# EAGLE design laserdriver_v3_1 (EAGLE 7.5.0)
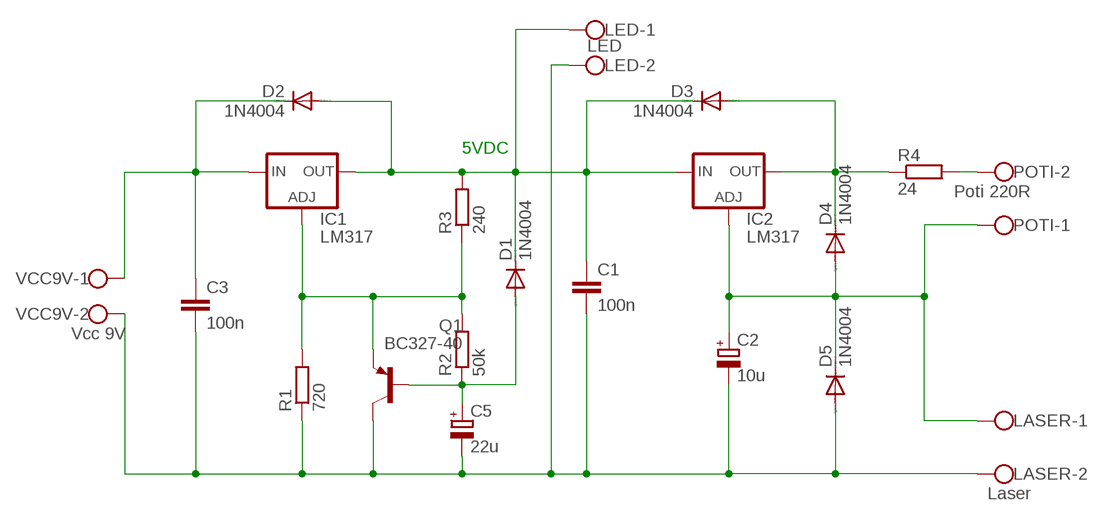
[diagram p0: schematic, sheet 1]

## Parts
C1  100n  C-EU050-024X044  [C050-024X044]
C2  10u  CPOL-EUE2-5  [E2-5]
C3  100n  C-EU050-024X044  [C050-024X044]
C5  22u  CPOL-EUE2-5  [E2-5]
D1  1N4004  [DO41-10]
D2  1N4004  [DO41-10]
D3  1N4004  [DO41-10]
D4  1N4004  [DO41-10]
D5  1N4004  [DO41-10]
IC1  LM317  LM317TS  [317TS]
IC2  LM317  LM317TS  [317TS]
LASER  Laser  W237-102  [W237-102]
LED  LED  W237-102  [W237-102]
POTI  Poti 220R  W237-102  [W237-102]
Q1  BC327-40  [TO92-EBC]
R1  720  R-EU_0207/7  [0207/7]
R2  50k  R-EU_0207/7  [0207/7]
R3  240  R-EU_0207/7  [0207/7]
R4  24  R-EU_0207/7  [0207/7]
VCC9V  Vcc 9V  W237-102  [W237-102]

## Nets
N$1: C1.1 D1.C D2.A D3.C IC1.2(OUT) IC2.3(IN) LED.1 R3.2
N$2: C2.+ D4.A D5.C IC2.1(ADJ) LASER.1 POTI.1
N$3: D3.A D4.C IC2.2(OUT) R4.1
N$4: POTI.2 R4.2
N$5: C5.+ D1.A Q1.B R2.1
N$7: C3.1 D2.C IC1.3(IN) VCC9V.1
N$9: C1.2 C2.- C3.2 C5.- D5.A LASER.2 LED.2 Q1.C R1.1 VCC9V.2
N$12: IC1.1(ADJ) Q1.E R1.2 R2.2 R3.1

## Notes on the sheet
- 5VDC

## Library data of the parts
C1 C3 = rcl:C-EU: CAPACITOR, European symbol
C2 C5 = rcl:CPOL-EU: POLARIZED CAPACITOR, European symbol
D1-D5 = diode:1N4004: DIODE general purpose rectifier, 1 A
IC1 IC2 = v-reg:LM317TS: VOLTAGE REGULATOR
LASER LED POTI VCC9V = con-wago-500:W237-102: WAGO SCREW CLAMP; MPN: 237-102; OC_FARNELL: unknown; OC_NEWARK: 70K9898
Q1 = transistor-pnp:BC327*: PNP Transistror
R1-R4 = rcl:R-EU_: RESISTOR, European symbol

## Board
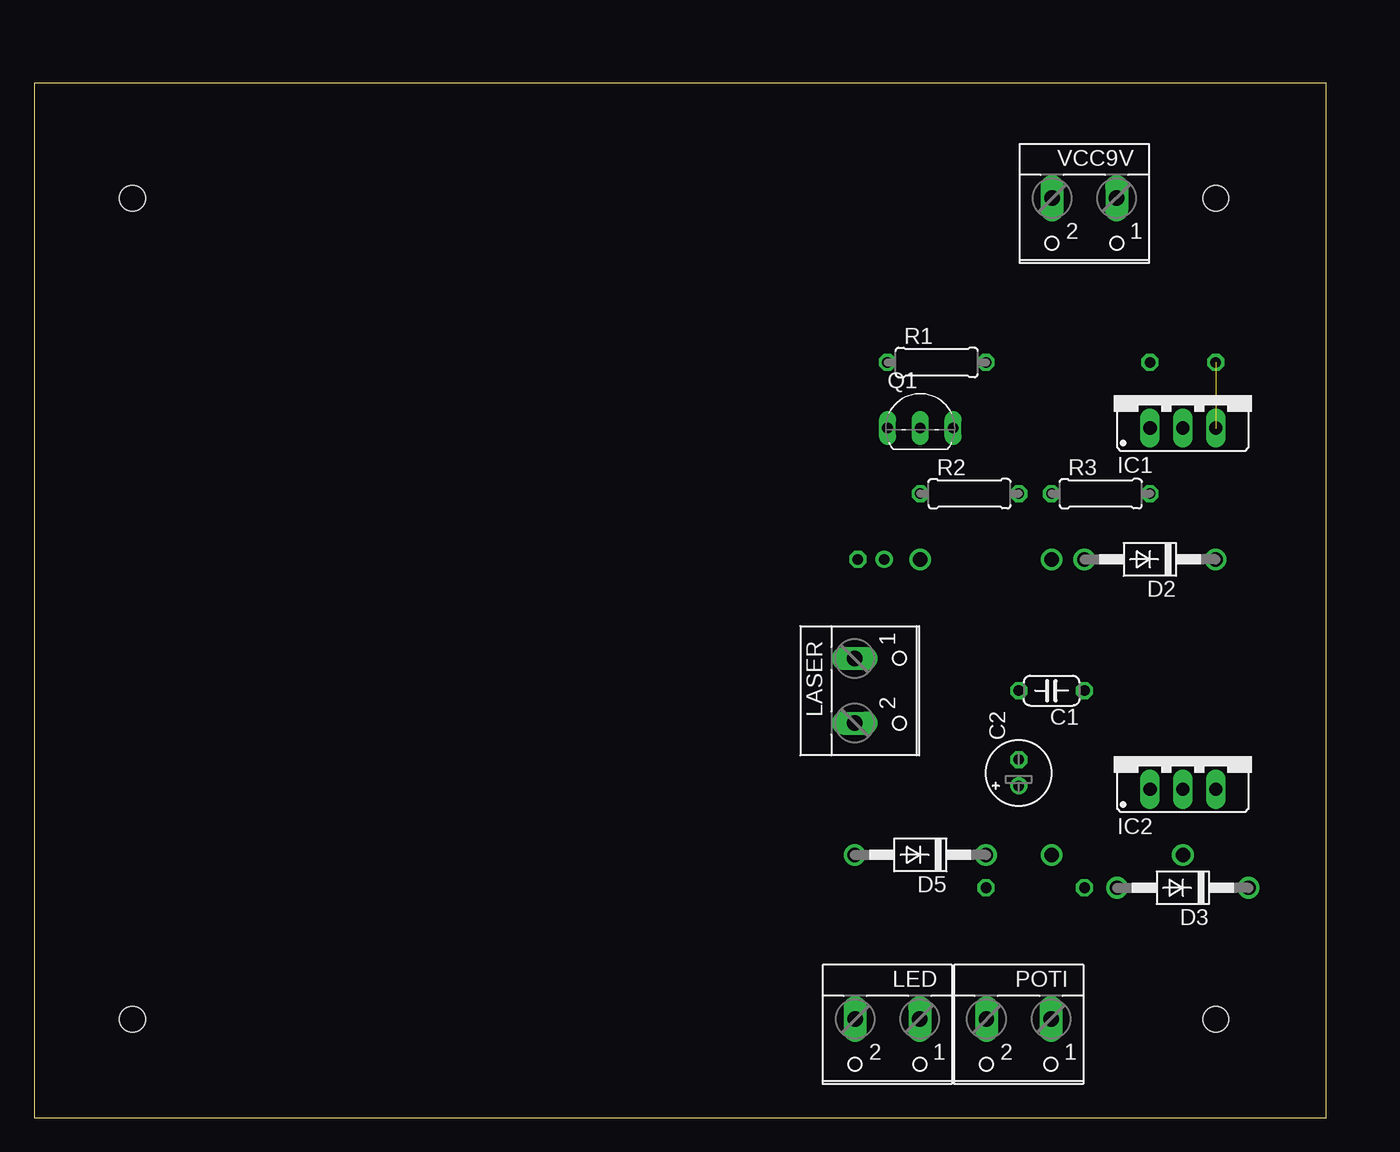
[diagram p1: board, top side]
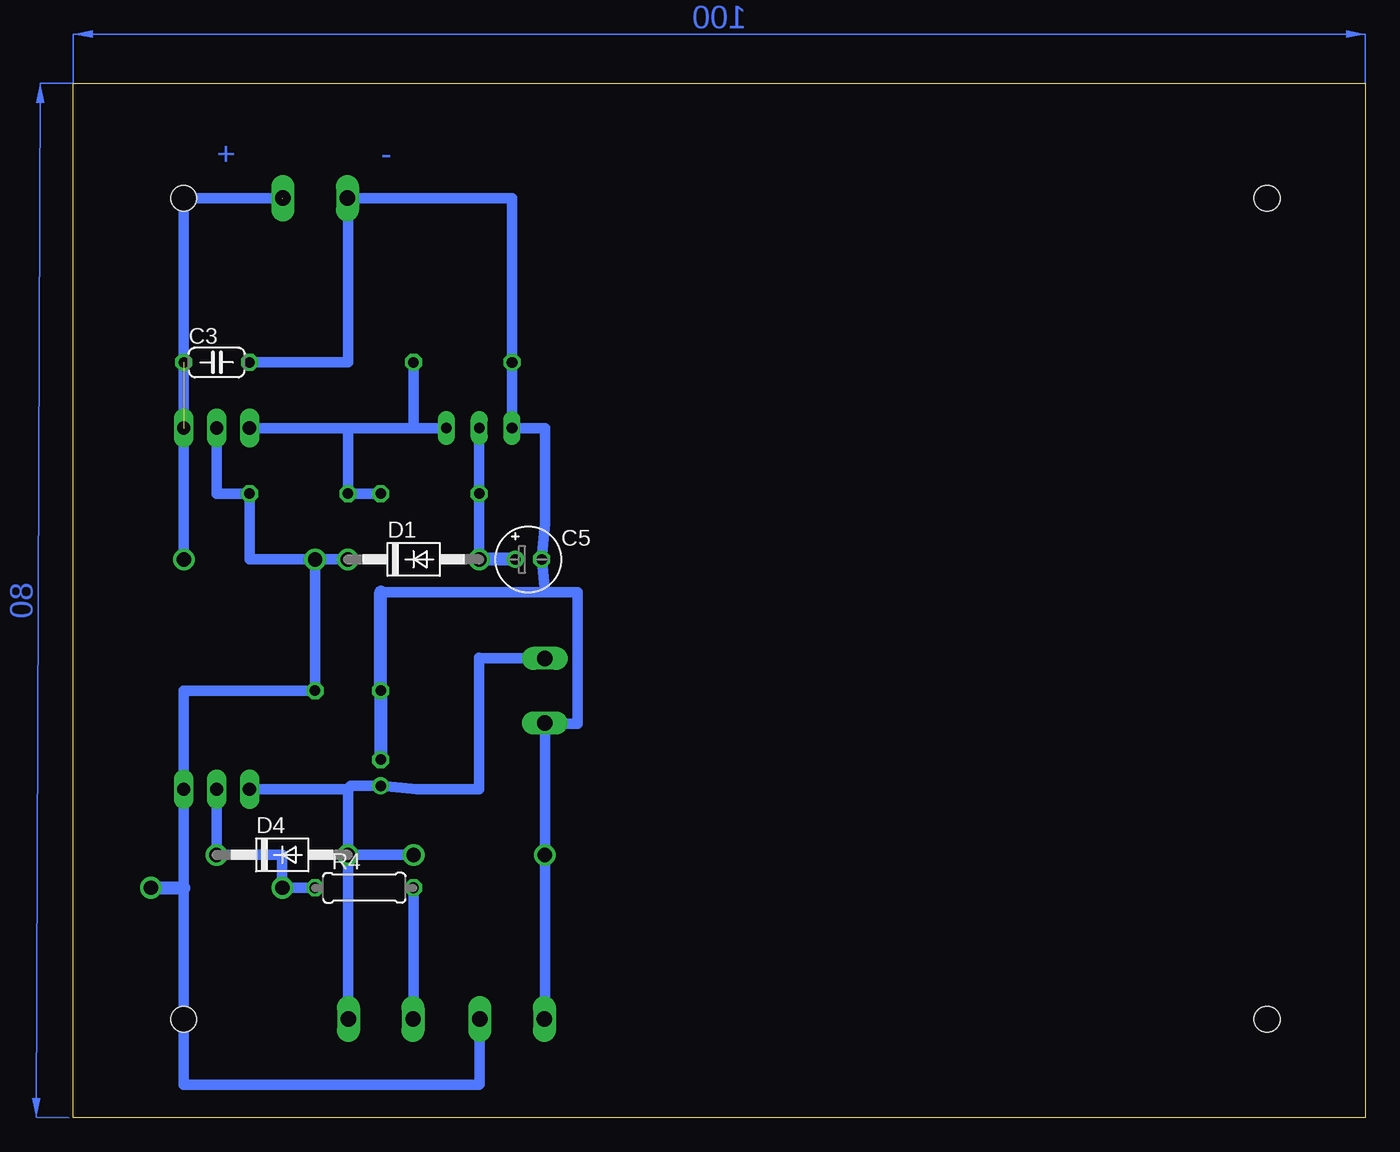
[diagram p2: board, bottom side, seen from below]

Size 100 x 80 mm. Coordinates in mm from the lower left corner, seen from the top.
Outline: 0,0 100,0 100,80 0,80 0,0
Copper layers (1*16): Top 0.035mm / dielectric 1.5mm / Bottom 0.035mm
Design rules "default *": minimum track width 15mil, minimum drill 24mil, track to track 10mil, track to pad 10mil, pad to pad 8mil, via to via 8mil, smd to smd 8mil, copper to edge 40mil, drill to drill 8mil, minimum pad ring 10mil, minimum via ring 8mil, stop-mask expansion 4mil, vias tented up to drill 0mil, thermal gap 10mil
Holes 2 mm at 7.62,71.12 91.44,71.12 91.44,7.62 7.62,7.62

### Footprints (pad centres in the part's own frame; a part is rotated, then mirrored left to right if it is on the bottom)
C050-024X044 = drill 0.813 octagon: 1 -2.54,0; 2 2.54,0
E2-5 = drill 0.813 pad 1.27: + -1.016,0 | drill 0.813 pad 1.27 octagon: - 1.016,0
DO41-10 = drill 1.118: A 5.08,0; C -5.08,0
317TS = drill 1.016 long: 1 -2.54,-2.54; 2 0,-2.54; 3 2.54,-2.54
W237-102 = drill 1.194 long: 1 -2.5,-1.27; 2 2.5,-1.27
TO92-EBC = drill 0.813 long: B 0,-1.27; C -2.54,-1.27; E 2.54,-1.27
0207/7 = drill 0.813 octagon: 1 -3.81,0; 2 3.81,0

### Placement (x,y rotation side)
C1  78.74,33.02 180 top
C2  76.2,26.67 90 top
C3  88.9,58.42 0 bottom
C5  64.77,43.18 0 bottom
D1  73.66,43.18 0 bottom
D2  86.36,43.18 180 top
D3  88.9,17.78 180 top
D4  83.82,20.32 0 bottom
D5  68.58,20.32 180 top
IC1  88.9,55.88 0 top
IC2  88.9,27.94 0 top
LASER  64.77,33.02 270 top
LED  66.04,6.35 180 top
POTI  76.2,6.35 180 top
Q1  68.58,54.61 0 top
R1  69.85,58.42 0 top
R2  72.39,48.26 0 top
R3  82.55,48.26 0 top
R4  77.47,17.78 0 bottom
VCC9V  81.28,69.85 180 top

### Tracks (layer width: path | path; a pad name or v marks a point on that pad's centre or on a via)
N$1
  Bottom 0.813: LED.1 68.54,2.58 68.58,2.54 91.44,2.54 91.44,17.78 IC2.3 91.44,33.02 C1.1 D2.A | IC1.2 88.9,48.26 R3.2 86.36,43.18 D2.A | D1.C D2.A
  Bottom 1.016: D3.C 91.44,17.78
N$2
  Bottom 0.813: POTI.1 78.74,7.62 D4.A | D5.C D4.A | LASER.1 68.54,35.52 68.58,35.56 68.58,25.4 73.41,25.4 C2.+ 78.49,25.65 78.74,25.4 | IC2.1 78.74,25.4 | 78.74,25.4 D4.A
N$3
  Bottom 0.813: R4.1 D3.A 83.82,20.32 D4.C IC2.2
N$4  (via drill 0.6)
  Bottom 0.61: 73.66,7.62 POTI.2
  Bottom 0.813: R4.2 v73.66,7.66 POTI.2
N$5
  Bottom 0.813: D1.A R2.1 Q1.B
  Bottom 1.016: C5.+ D1.A
N$7  (2 unrouted)
  Bottom 0.813: 83.82,71.12 91.44,71.12 IC1.3 D2.C
N$9
  Bottom 0.61: LED.2 63.5,8.89
  Bottom 0.813: LASER.2 63.5,30.48 | 63.5,30.48 D5.A 63.5,7.66 LED.2 | C3.2 78.74,58.42 78.74,71.12 VCC9V.2 66.04,71.12 R1.1 Q1.C 63.5,53.34 63.5,45.97 C5.- 63.75,43.43 63.5,40.64 | 76.2,40.64 63.5,40.64 | 63.5,40.64 60.96,40.64 60.96,30.48 63.5,30.48
  Bottom 1.016: C2.- C1.2 76.2,40.64
N$12
  Bottom 0.813: R1.2 73.66,53.34 | IC1.1 78.74,53.34 | 78.74,53.34 73.66,53.34 | 73.66,53.34 Q1.E | R2.2 R3.1 78.74,53.34
(copper drawn outside any net)
  shapes: Bottom area x2

### Text on the board
Bottom: - | +